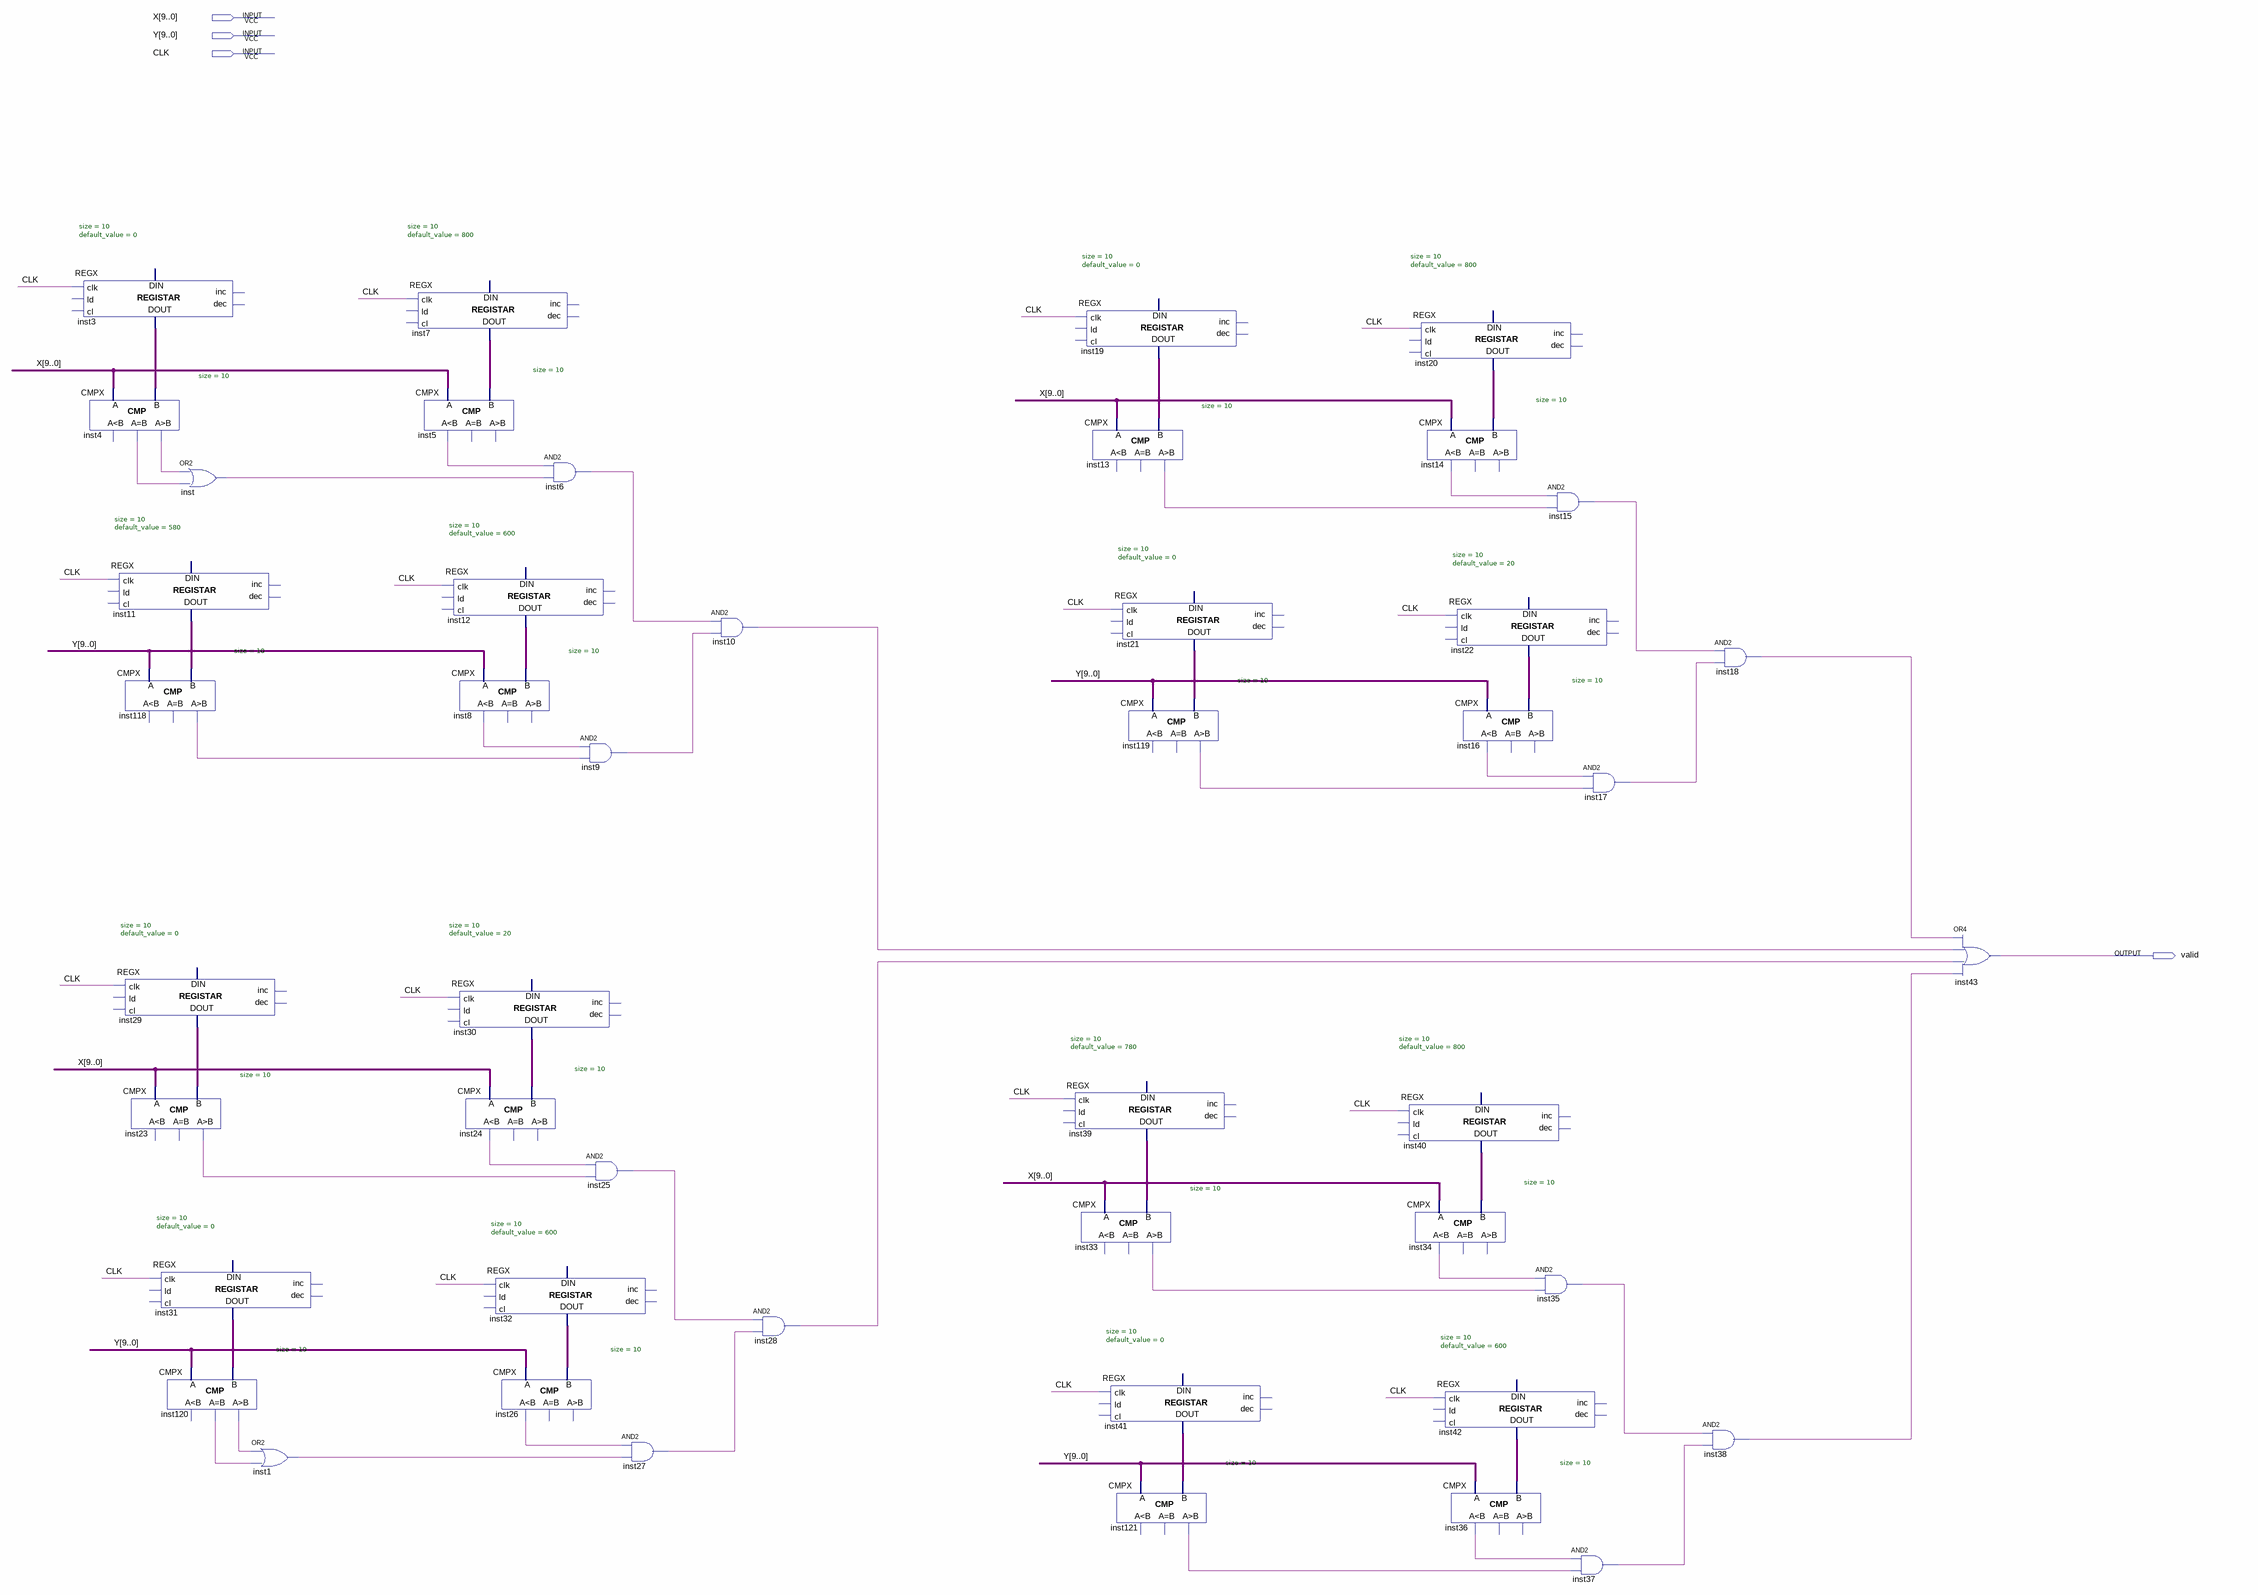
[diagram p0: schematic sheet]
// Quartus schematic okvir.bdf as structural Verilog: 47 symbols, 4 pins
module okvir (
  input  [9:0] X,
  input  [9:0] Y,
  input  CLK,
  output valid
);

  wire inst1_out, inst4_eq, inst4_gr, inst5_ls, inst6_out, inst8_ls, inst9_out, inst10_out, inst13_gr,
       inst14_ls, inst15_out, inst16_ls, inst17_out, inst18_out, inst23_gr, inst24_ls, inst25_out, inst26_ls,
       inst27_out, inst28_out, inst33_gr, inst34_ls, inst35_out, inst36_ls, inst37_out, inst38_out,
       inst118_gr, inst119_gr, inst120_eq, inst120_gr, inst121_gr, inst_out;
  wire [9:0] inst3_data_out, inst7_data_out, inst11_data_out, inst12_data_out, inst19_data_out,
       inst20_data_out, inst21_data_out, inst22_data_out, inst29_data_out, inst30_data_out, inst31_data_out,
       inst32_data_out, inst39_data_out, inst40_data_out, inst41_data_out, inst42_data_out;

  REGX #(.size(10), .default_value(0)) inst3 (.clk(CLK), .data_out(inst3_data_out));  // open: ld, cl, inc, dec, data_in
  CMPX #(.size(10)) inst4 (.A(X), .B(inst3_data_out), .eq(inst4_eq), .gr(inst4_gr));  // open: ls
  REGX #(.size(10), .default_value(580)) inst11 (
    .clk(CLK), .data_out(inst11_data_out));  // open: ld, cl, inc, dec, data_in
  CMPX #(.size(10)) inst118 (.A(Y), .B(inst11_data_out), .gr(inst118_gr));  // open: ls, eq
  REGX #(.size(10), .default_value(0)) inst29 (
    .clk(CLK), .data_out(inst29_data_out));  // open: ld, cl, inc, dec, data_in
  CMPX #(.size(10)) inst23 (.A(X), .B(inst29_data_out), .gr(inst23_gr));  // open: ls, eq
  REGX #(.size(10), .default_value(0)) inst31 (
    .clk(CLK), .data_out(inst31_data_out));  // open: ld, cl, inc, dec, data_in
  or inst (inst_out, inst4_gr, inst4_eq);
  CMPX #(.size(10)) inst120 (.A(Y), .B(inst31_data_out), .eq(inst120_eq), .gr(inst120_gr));  // open: ls
  or inst1 (inst1_out, inst120_gr, inst120_eq);
  REGX #(.size(10), .default_value(800)) inst7 (
    .clk(CLK), .data_out(inst7_data_out));  // open: ld, cl, inc, dec, data_in
  CMPX #(.size(10)) inst5 (.A(X), .B(inst7_data_out), .ls(inst5_ls));  // open: eq, gr
  REGX #(.size(10), .default_value(600)) inst12 (
    .clk(CLK), .data_out(inst12_data_out));  // open: ld, cl, inc, dec, data_in
  CMPX #(.size(10)) inst8 (.A(Y), .B(inst12_data_out), .ls(inst8_ls));  // open: eq, gr
  REGX #(.size(10), .default_value(20)) inst30 (
    .clk(CLK), .data_out(inst30_data_out));  // open: ld, cl, inc, dec, data_in
  CMPX #(.size(10)) inst24 (.A(X), .B(inst30_data_out), .ls(inst24_ls));  // open: eq, gr
  REGX #(.size(10), .default_value(600)) inst32 (
    .clk(CLK), .data_out(inst32_data_out));  // open: ld, cl, inc, dec, data_in
  CMPX #(.size(10)) inst26 (.A(Y), .B(inst32_data_out), .ls(inst26_ls));  // open: eq, gr
  and inst6 (inst6_out, inst5_ls, inst_out);
  and inst9 (inst9_out, inst8_ls, inst118_gr);
  and inst25 (inst25_out, inst24_ls, inst23_gr);
  and inst27 (inst27_out, inst26_ls, inst1_out);
  and inst10 (inst10_out, inst6_out, inst9_out);
  and inst28 (inst28_out, inst25_out, inst27_out);
  REGX #(.size(10), .default_value(0)) inst19 (
    .clk(CLK), .data_out(inst19_data_out));  // open: ld, cl, inc, dec, data_in
  CMPX #(.size(10)) inst13 (.A(X), .B(inst19_data_out), .gr(inst13_gr));  // open: ls, eq
  REGX #(.size(10), .default_value(780)) inst39 (
    .clk(CLK), .data_out(inst39_data_out));  // open: ld, cl, inc, dec, data_in
  CMPX #(.size(10)) inst33 (.A(X), .B(inst39_data_out), .gr(inst33_gr));  // open: ls, eq
  REGX #(.size(10), .default_value(0)) inst41 (
    .clk(CLK), .data_out(inst41_data_out));  // open: ld, cl, inc, dec, data_in
  CMPX #(.size(10)) inst121 (.A(Y), .B(inst41_data_out), .gr(inst121_gr));  // open: ls, eq
  REGX #(.size(10), .default_value(0)) inst21 (
    .clk(CLK), .data_out(inst21_data_out));  // open: ld, cl, inc, dec, data_in
  CMPX #(.size(10)) inst119 (.A(Y), .B(inst21_data_out), .gr(inst119_gr));  // open: ls, eq
  REGX #(.size(10), .default_value(800)) inst20 (
    .clk(CLK), .data_out(inst20_data_out));  // open: ld, cl, inc, dec, data_in
  CMPX #(.size(10)) inst14 (.A(X), .B(inst20_data_out), .ls(inst14_ls));  // open: eq, gr
  REGX #(.size(10), .default_value(800)) inst40 (
    .clk(CLK), .data_out(inst40_data_out));  // open: ld, cl, inc, dec, data_in
  CMPX #(.size(10)) inst34 (.A(X), .B(inst40_data_out), .ls(inst34_ls));  // open: eq, gr
  REGX #(.size(10), .default_value(600)) inst42 (
    .clk(CLK), .data_out(inst42_data_out));  // open: ld, cl, inc, dec, data_in
  CMPX #(.size(10)) inst36 (.A(Y), .B(inst42_data_out), .ls(inst36_ls));  // open: eq, gr
  REGX #(.size(10), .default_value(20)) inst22 (
    .clk(CLK), .data_out(inst22_data_out));  // open: ld, cl, inc, dec, data_in
  CMPX #(.size(10)) inst16 (.A(Y), .B(inst22_data_out), .ls(inst16_ls));  // open: eq, gr
  and inst35 (inst35_out, inst34_ls, inst33_gr);
  and inst15 (inst15_out, inst14_ls, inst13_gr);
  and inst17 (inst17_out, inst16_ls, inst119_gr);
  and inst37 (inst37_out, inst36_ls, inst121_gr);
  and inst18 (inst18_out, inst15_out, inst17_out);
  and inst38 (inst38_out, inst35_out, inst37_out);
  or inst43 (valid, inst18_out, inst10_out, inst28_out, inst38_out);
endmodule
